# EAGLE design 1btn_v1 (EAGLE 7.3.0)
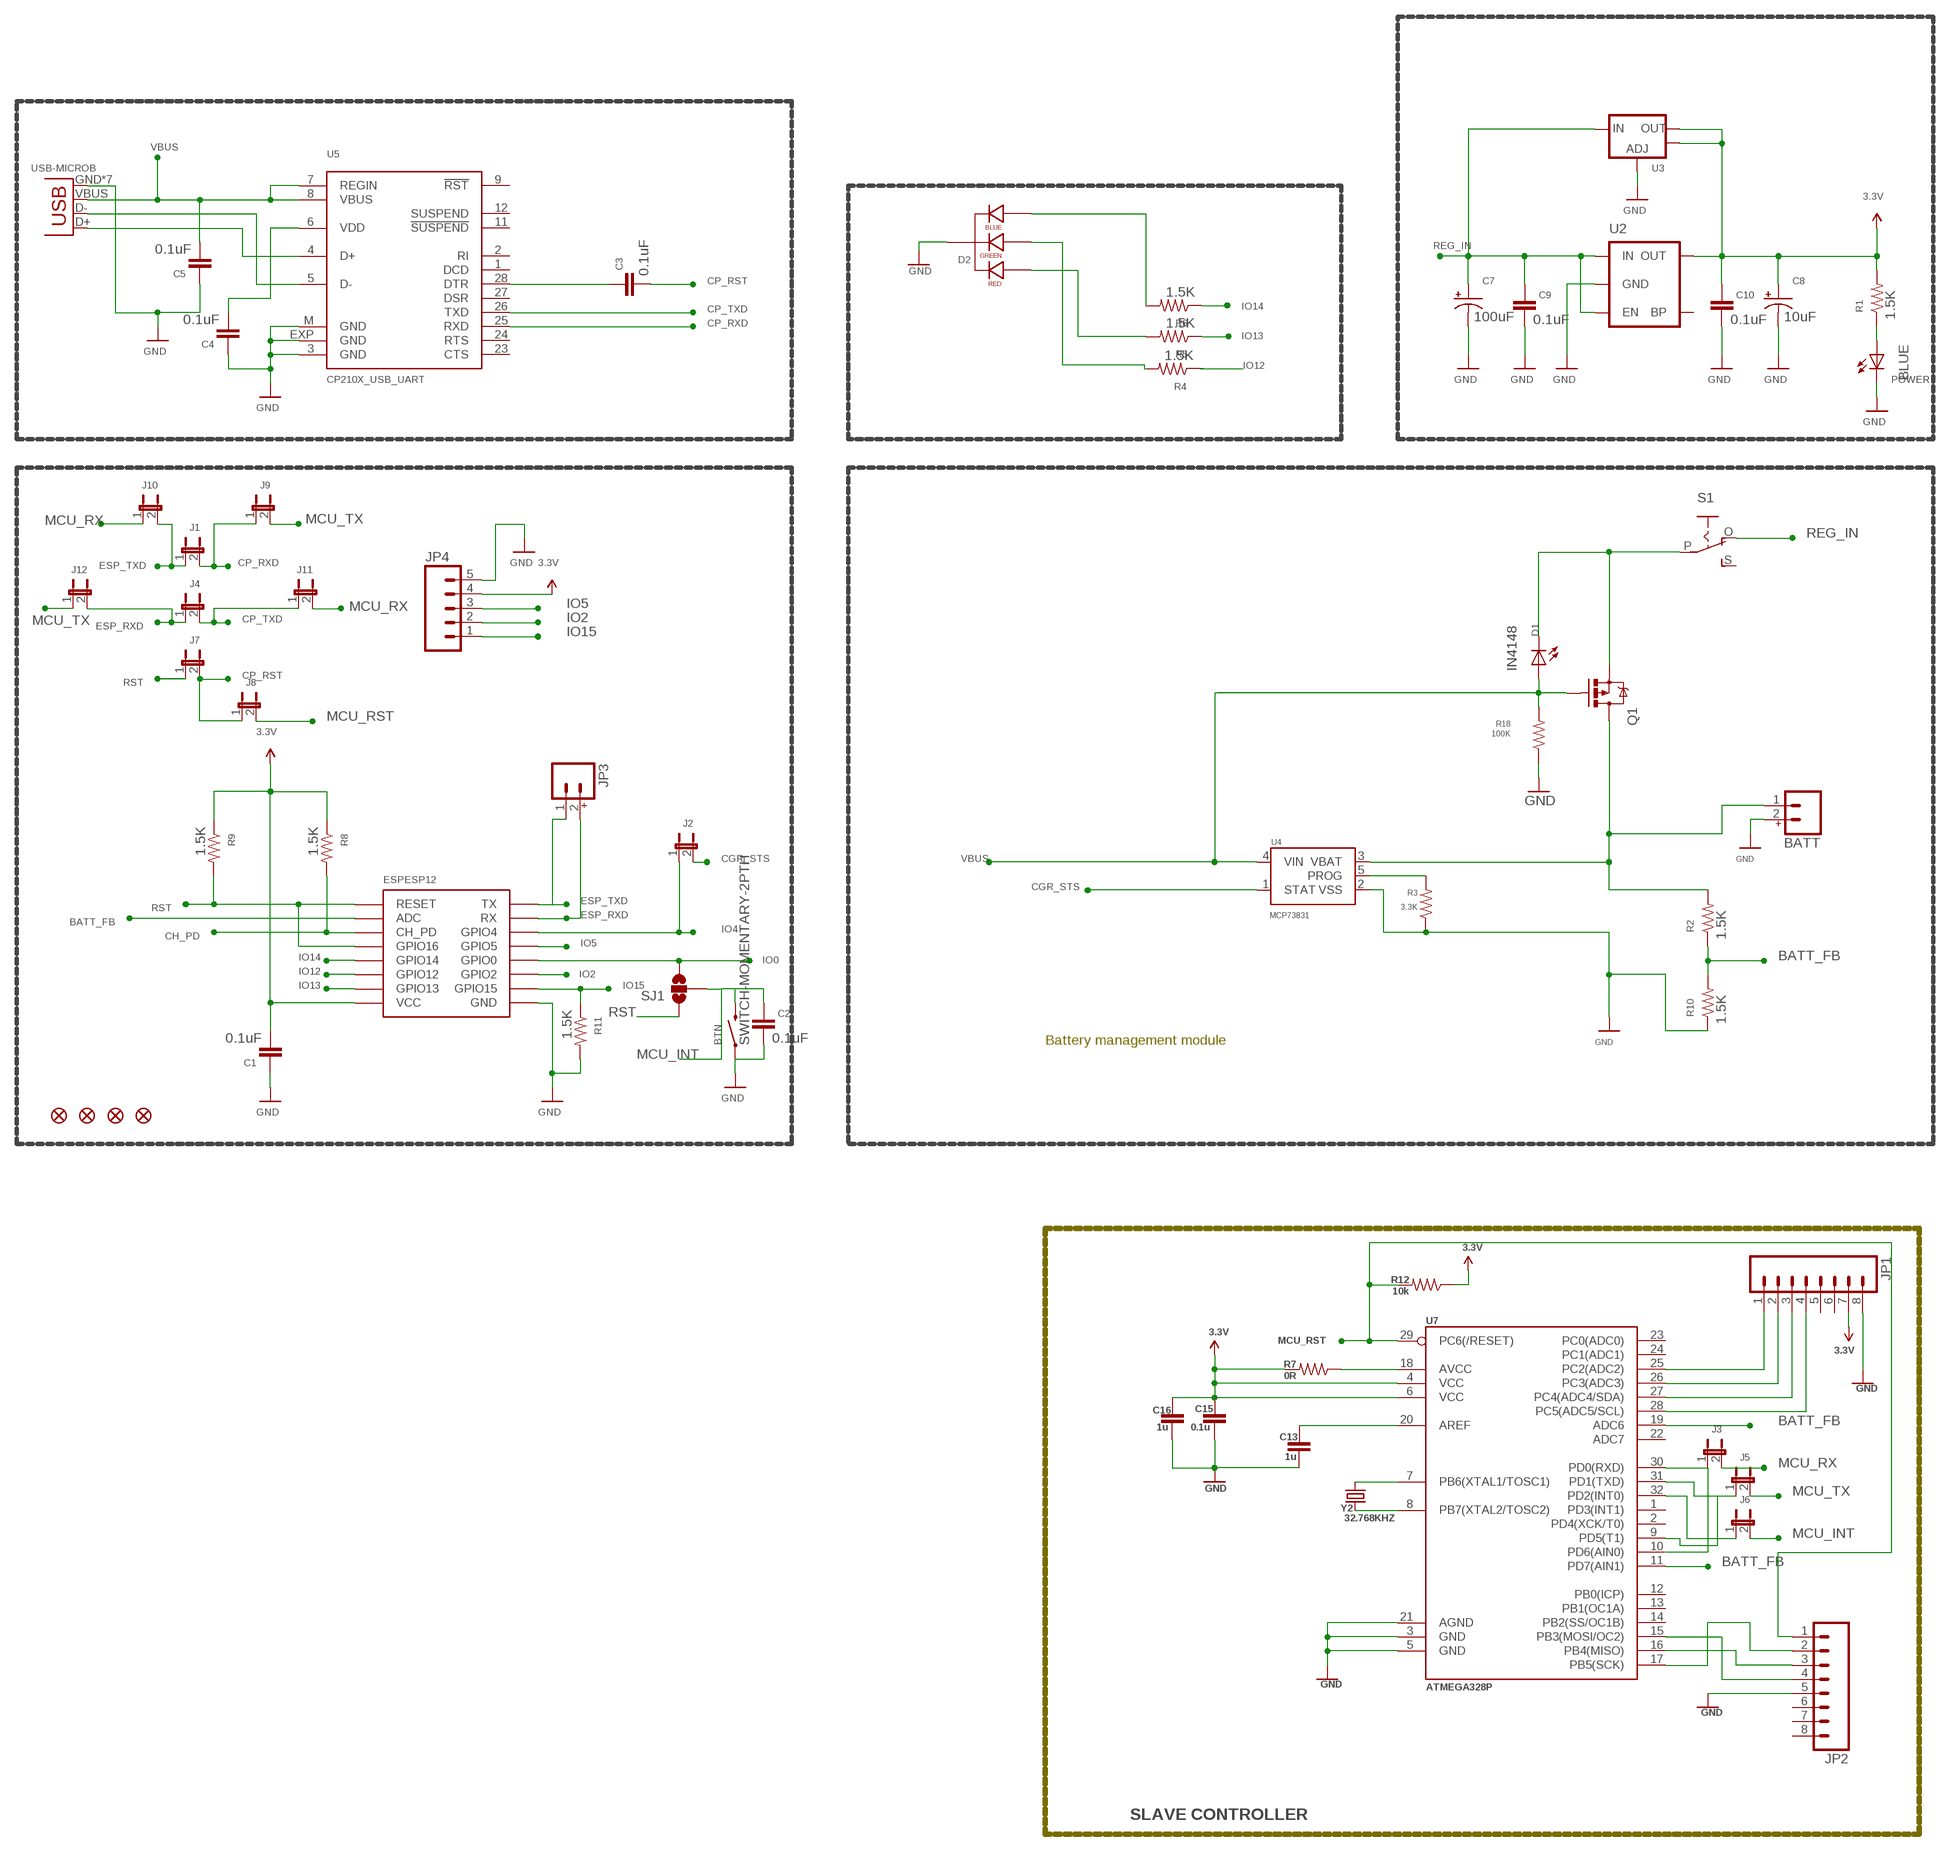
[diagram p0: schematic, sheet 1]

## Parts
BATT  M02JST-PTH-2  [JST-2-PTH]
BTN  SWITCH-MOMENTARY-2PTH  [TACTILE-PTH]
C1  0.1uF  CAP0805  [0805]
C2  0.1uF  CAP0805  [0805]
C3  0.1uF  CAP0805  [0805]
C4  0.1uF  CAP0805  [0805]
C5  0.1uF  CAP0805  [0805]
C7  100uF  CAP_POL1206-KIT  [EIA3216-KIT]
C8  10uF  CAP_POL1206-KIT  [EIA3216-KIT]
C9  0.1uF  CAP0805  [0805]
C10  0.1uF  CAP0805  [0805]
C13  1u  CAP0805  [0805]
C15  0.1u  CAP0805  [0805]
C16  1u  CAP0805  [0805]
D1  IN4148  LED1206  [LED-1206]
D2  LED-RGB-CC-THRUCLEAR  [LED-RGB-THRU]
ESP  ESP12  [ESP12]
FID1  FIDUCIAL1X2  [FIDUCIAL-1X2]
FID2  FIDUCIAL1X2  [FIDUCIAL-1X2]
FID3  FIDUCIAL1X2  [FIDUCIAL-1X2]
FID4  FIDUCIAL1X2  [FIDUCIAL-1X2]
J1  JUMPER-2SMD-NC  [SJ_2S]
J2  JUMPER-2SMD-NC  [SJ_2S]
J3  JUMPER-2SMD-NC  [SJ_2S]
J4  JUMPER-2SMD-NC  [SJ_2S]
J5  JUMPER-2SMD-NC  [SJ_2S]
J6  JUMPER-2SMD-NC  [SJ_2S]
J7  JUMPER-2SMD-NC  [SJ_2S]
J8  JUMPER-2SMD-NC  [SJ_2S]
J9  JUMPER-2SMD-NC  [SJ_2S]
J10  JUMPER-2SMD-NC  [SJ_2S]
J11  JUMPER-2SMD-NC  [SJ_2S]
J12  JUMPER-2SMD-NC  [SJ_2S]
JP1  M08NO_SILK  [1X08_PIN1_NO_SILK]
JP2  M08NO_SILK  [1X08_PIN1_NO_SILK]
JP3  M02PTH  [1X02]
JP4  M05PTH  [1X05]
POWER  BLUE  LED  [LED-0805]
Q1  MOSFET-PCHANNELSMD  [SOT23-3]
R1  1.5K  RESISTOR0805-RES  [0805]
R2  1.5K  RESISTOR0805-RES  [0805]
R3  3.3K  RESISTOR0805-RES  [0805]
R4  1.5K  RESISTOR0805-RES  [0805]
R5  1.5K  RESISTOR0805-RES  [0805]
R6  1.5K  RESISTOR0805-RES  [0805]
R7  0R  RESISTOR0805-RES  [0805]
R8  1.5K  RESISTOR0805-RES  [0805]
R9  1.5K  RESISTOR0805-RES  [0805]
R10  1.5K  RESISTOR0805-RES  [0805]
R11  1.5K  RESISTOR0805-RES  [0805]
R12  10k  RESISTOR0805-RES  [0805]
R18  100K  RESISTOR0805-RES  [0805]
S1  EG1218S  [EG1218]
SJ1  SOLDERJUMPER_2WAYS  [SJ_3]
U2  MIC52053.3V  [SOT23-5]
U3  V_REG_LM1117SOT223  [SOT223]
U4  MCP73831  [SOT23-5]
U5  CP210X_USB_UART  [MLP28]
U7  ATMEGA328P  ATMEGA328_SMT  [TQFP32-08]
USB  USB-MICROB  [USB-MICROB]
Y2  32.768KHZ  CRYSTALTC26H_EZ  [TC26HEZ]

## Nets
3.3V: C1.2 C8.A(+) C10.1 C15.1 C16.1 ESP.VCC JP1.7 JP4.4 R1.2 R7.2 R8.1 R9.1 R12.1 U2.5(OUT) U3.2(OUT) U3.4(OUT) U7.4(VCC) U7.6(VCC)
BA: D2.3(GREEN_CATHODE) R4.2
BATT+: BATT.1 Q1.3(D) R2.2 U4.3(VBAT)
BATT_FB: ESP.ADC R2.1 R10.2 U7.11(PD7(AIN1)) U7.19(ADC6)
CGR_STS: J2.2 U4.1(STAT)
CH_PD: ESP.CH_PD R8.2
CP_RST: C3.2 J7.2 J8.1
CP_RXD: J1.2 J9.1 U5.25(RXD)
CP_TXD: J4.2 J11.1 U5.26(TXD)
ESP_RXD: ESP.RX J4.1 J12.2 JP3.2
ESP_TXD: ESP.TX J1.1 J10.2 JP3.1
GND: BATT.2 BTN.1 C1.1 C2.2 C4.1 C5.1 C7.C(-) C8.C(-) C9.2 C10.2 C13.2 C15.2 C16.2 D2.2(CATHODE) ESP.GND JP1.8 JP2.5 JP4.5 POWER.2(C) R3.1 R10.1 R11.2 R18.1 U2.2(GND) U3.1(ADJ) U4.2(VSS) U5.3(GND) U5.EXP(GND) U5.M(GND) U7.3(GND) U7.5(GND) U7.21(AGND) USB.GND USB.MT1(GND) USB.MT2(GND) USB.MT3(GND) USB.MT4(GND) USB.P$1(GND) USB.P$2(GND)
IO0: ESP.GPIO0 SJ1.3
IO2: ESP.GPIO2 JP4.2
IO4: ESP.GPIO4 J2.1
IO5: ESP.GPIO5 JP4.3
IO12: ESP.GPIO12 R4.1
IO13: ESP.GPIO13 R5.1
IO14: ESP.GPIO14 R6.1
IO15: ESP.GPIO15 JP4.1 R11.1
MCU_INT: BTN.3 C2.1 J6.2 SJ1.2
MCU_RST: J8.2 JP2.1 R12.2 U7.29(PC6(/RESET))
MCU_RX: J3.2 J10.1 J11.2
MCU_TX: J5.2 J9.2 J12.1
N$1: D2.1(RED_CATHODE) R5.2
N$2: D2.4(BLUE_CATHODE) R6.2
N$4: D1.C Q1.2(S) S1.P
N$5: U5.5(D-) USB.D-
N$6: C3.1 U5.28(DTR)
N$7: POWER.1(A) R1.1
N$8: U5.4(D+) USB.D+
N$11: JP1.1 U7.25(PC2(ADC2))
N$12: JP1.2 U7.26(PC3(ADC3))
N$13: JP1.3 U7.27(PC4(ADC4/SDA))
N$14: JP1.4 U7.28(PC5(ADC5/SCL))
N$15: R3.2 U4.5(PROG)
N$16: JP2.4 U7.15(PB3(MOSI/OC2))
N$17: JP2.3 U7.16(PB4(MISO))
N$18: JP2.2 U7.17(PB5(SCK))
N$19: J3.1 U7.10(PD6(AIN0)) U7.30(PD0(RXD))
N$20: J6.1 U7.32(PD2(INT0))
N$21: J5.1 U7.9(PD5(T1)) U7.31(PD1(TXD))
N$28: U7.7(PB6(XTAL1/TOSC1)) Y2.2
N$29: U7.8(PB7(XTAL2/TOSC2)) Y2.1
N$30: C13.1 U7.20(AREF)
N$33: R7.1 U7.18(AVCC)
REG_IN: C7.A(+) C9.1 S1.O U2.1(IN) U2.3(EN) U3.3(IN)
RST: ESP.GPIO16 ESP.RESET J7.1 R9.2 SJ1.1
VBUS: C5.2 D1.A Q1.1(G) R18.2 U4.4(VIN) U5.7(REGIN) U5.8(VBUS) USB.VBUS
VDD: C4.2 U5.6(VDD)
Unconnected: JP1.5 JP1.6 JP2.6 JP2.7 JP2.8 S1.S U2.4(BP) U5.1(DCD) U5.2(RI) U5.9(!RST) U5.11(!SUSPEND) U5.12(SUSPEND) U5.23(CTS) U5.24(RTS) U5.27(DSR) U7.1(PD3(INT1)) U7.2(PD4(XCK/T0)) U7.12(PB0(ICP)) U7.13(PB1(OC1A)) U7.14(PB2(SS/OC1B)) U7.22(ADC7) U7.23(PC0(ADC0)) U7.24(PC1(ADC1))

## Notes on the sheet
- Battery management module
- SLAVE CONTROLLER

## Library data of the parts
BATT = SparkFun-Connectors:M02: Standard 2-pin 0.1" header. Use with - straight break away headers ( PRT-00116) - right angle break away headers (PRT-00553) - swiss pins (PRT-00743) - machine pins (PRT-00117) - female headers (PRT-00115) Molex polarized connector foot print use with: PRT-08233 with associated crimp pins and housings. 2.54_SCREWTERM for use with PRT-10571. 3.5mm Screw Terminal footprints for PRT-08084 5mm Screw Terminal footprints for use with PRT-08432; PROD_ID: CONN-09863; SKU: PRT-09914
BTN = SparkFun-Electromechanical:SWITCH-MOMENTARY-2: Various NO switches- pushbuttons, reed, etc
C1-C5 C9 C10 = SparkFun-Passives:CAP: Capacitor Standard 0603 ceramic capacitor, and 0.1" leaded capacitor.
C7 C8 = SparkFun-Passives:CAP_POL: Capacitor Polarized These are standard SMD and PTH capacitors. Normally 10uF, 47uF, and 100uF in electrolytic and tantalum varieties. Always verify the external diameter of the through hole cap, it varies with capacity, voltage, and manufacturer. The EIA devices should be standard.
C13 C15 C16 = SparkFun-Capacitors:CAP: Capacitor Standard 0603 ceramic capacitor, and 0.1" leaded capacitor.
D1 POWER = SparkFun-LED:LED: LEDs Standard schematic elements and footprints for 5mm, 3mm, 1206, and 0603 sized LEDs. 5mm - Spark Fun Electronics SKU : COM-00529 (and others)
D2 = SparkFun-LED:LED-RGB-CC-THRU: RGB Through-hole common cathode LED SparkFun Storefront: COM-00105 (Clear) COM-09264 (Diffuse); PROD_ID: DIO-08418
ESP = esp8266modules:ESP12: ESP8266 Wifi module 12
FID1-FID4 = SparkFun-Aesthetics:FIDUCIAL: Fiducial Alignment Points Various fiducial points for machine vision alignment.
J1-J12 = SparkFun-Passives:JUMPER-2: Jumper Basic 0.1" spaced jumper. Use with breakaway headers.
JP1 JP2 = SparkFun-Connectors:M08: Header 8 Standard 8-pin 0.1" header. Use with straight break away headers (SKU : PRT-00116), right angle break away headers (PRT-00553), swiss pins (PRT-00743), machine pins (PRT-00117), and female headers (PRT-00115).
JP3 = SparkFun-Connectors:M02: Standard 2-pin 0.1" header. Use with - straight break away headers ( PRT-00116) - right angle break away headers (PRT-00553) - swiss pins (PRT-00743) - machine pins (PRT-00117) - female headers (PRT-00115) Molex polarized connector foot print use with: PRT-08233 with associated crimp pins and housings. 2.54_SCREWTERM for use with PRT-10571. 3.5mm Screw Terminal footprints for PRT-08084 5mm Screw Terminal footprints for use with PRT-08432
JP4 = SparkFun-Connectors:M05: Header 5 Standard 5-pin 0.1" header. Use with straight break away headers (SKU : PRT-00116), right angle break away headers (PRT-00553), swiss pins (PRT-00743), machine pins (PRT-00117), and female headers (PRT-00115). Molex polarized connector foot print use with SKU : PRT-08230 with associated crimp pins and housings.
Q1 = SparkFun-DiscreteSemi:MOSFET-PCHANNEL: Generic PMOSFET
R1-R12 R18 = SparkFun-Resistors:RESISTOR: Resistor Basic schematic elements and footprints for 0603, 1206, and PTH resistors.
S1 = adafruit:EG1218: SLIDING SWITCH 0.1" spacing through hole, vertical SPDT slide switch http://www.ladyada.net/library/pcb/eaglelibrary.html
SJ1 = SparkFun-Passives:SOLDERJUMPER_2WAY: Solder Jumper 2 way solder jumper
U2 = SparkFun-PowerIC:MIC5205: MIC5205 150mA vreg 3.3V - VREG-00822 5V - VREG-00823; PROD_ID: VREG-00822
U3 = SparkFun-PowerIC:V_REG_LM1117: Voltage Regulator LM1117 Standard adjustable voltage regulator but in SMD form. Spark Fun Electronics SKU : COM-00595
U4 = SparkFun-PowerIC:MCP73831: Miniature single cell, fully integrated Li-Ion, Li-polymer charge management controller http://ww1.microchip.com/downloads/en/DeviceDoc/21984a.pdf IC-09995; PROD_ID: IC-09995
U5 = SparkFun-DigitalIC:CP210X_USB_UART: Single-Chip USB to UART Bridge Source: www.silabs.com .. CP2101.pdf / cp2102.pdf. Spark Fun Electronics SKU : COM-00310
U7 = SparkFun-DigitalIC:ATMEGA328_SMT: 32-Pin Atmega328 part Commonly used on Arduino compatible boards Available in QFP and QFN packages TQFP is IC-09069 QFN is non-stock; PROD_ID: IC-09069
USB = SparkFun-Connectors:USB: USB Connectors USB-B-PTH is fully proven SKU : PRT-00139/CONN-08278 USB-miniB is fully proven SKU : PRT-00587 USB-A-PCB is untested. USB-A-H is throughly reviewed, but untested. Spark Fun Electronics SKU : PRT-00437 USB-B-SMT is throughly reviewed, but untested. Needs silkscreen touching up. USB-A-S has not been used/tested USB-MB-H has not been used/tested USB-MICROB has been used. CONN-09505; PROD_ID: CONN-09505
Y2 = SparkFun-FreqCtrl:CRYSTAL: Various standard crystals. Proven footprints. Spark Fun Electronics SKU : COM-00534

## Board
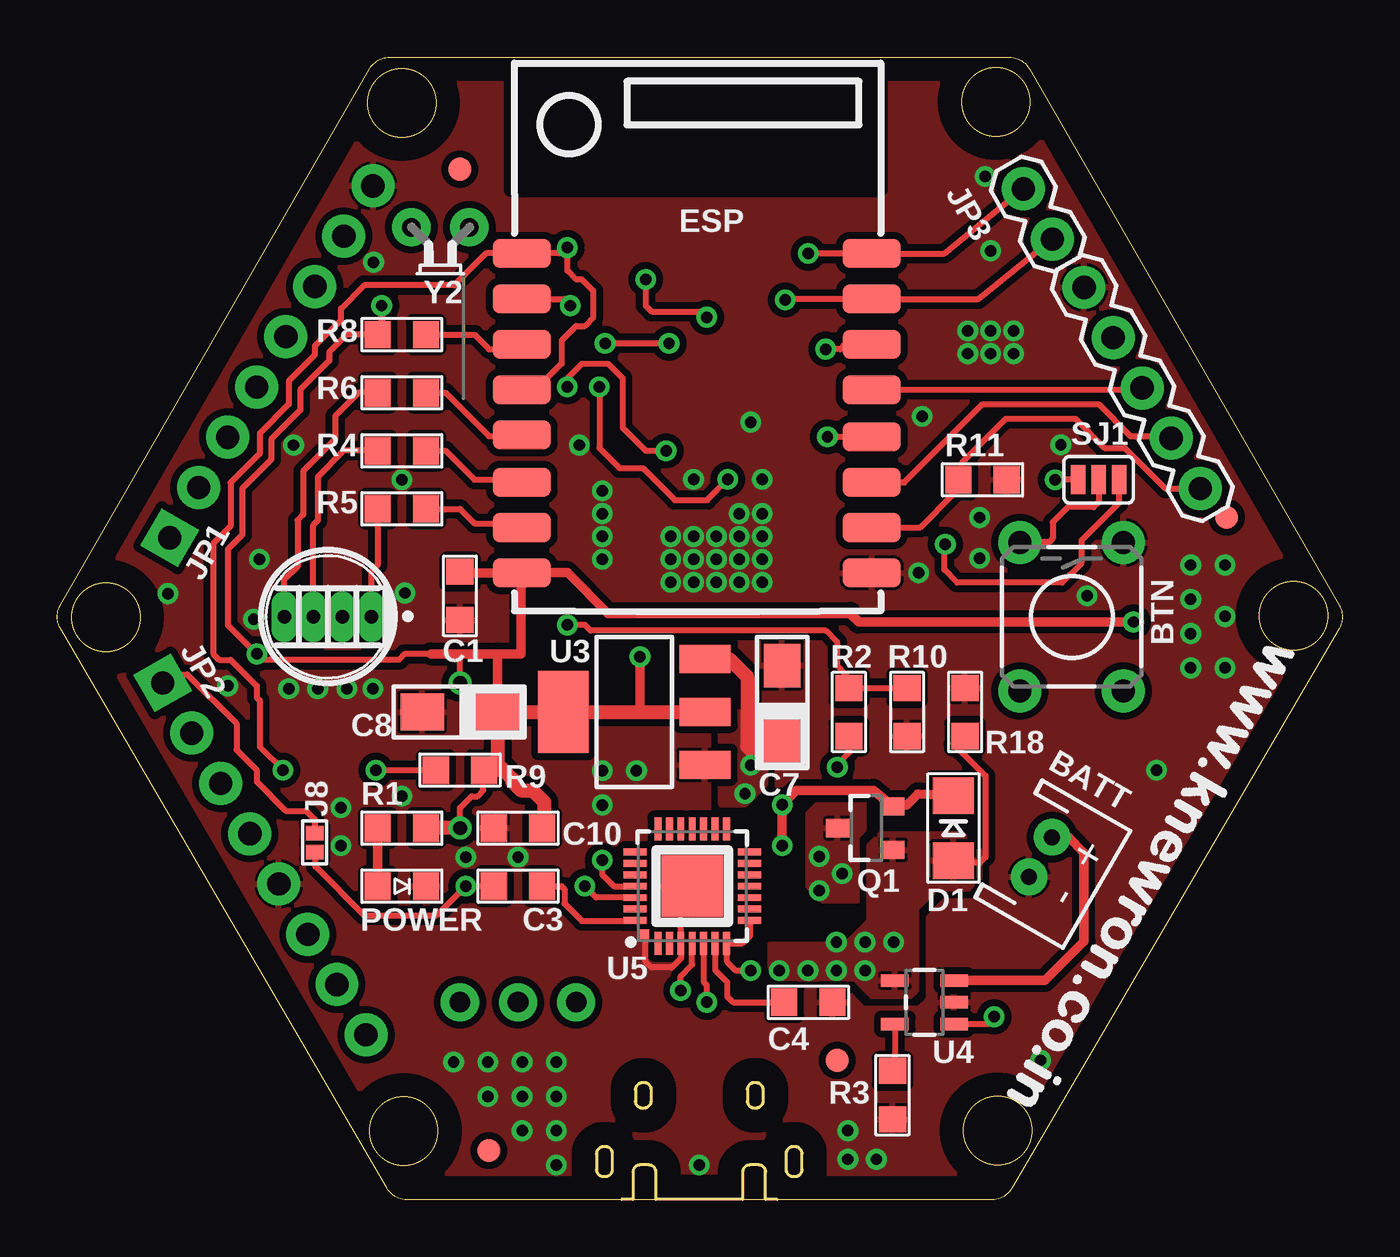
[diagram p1: board, top side]
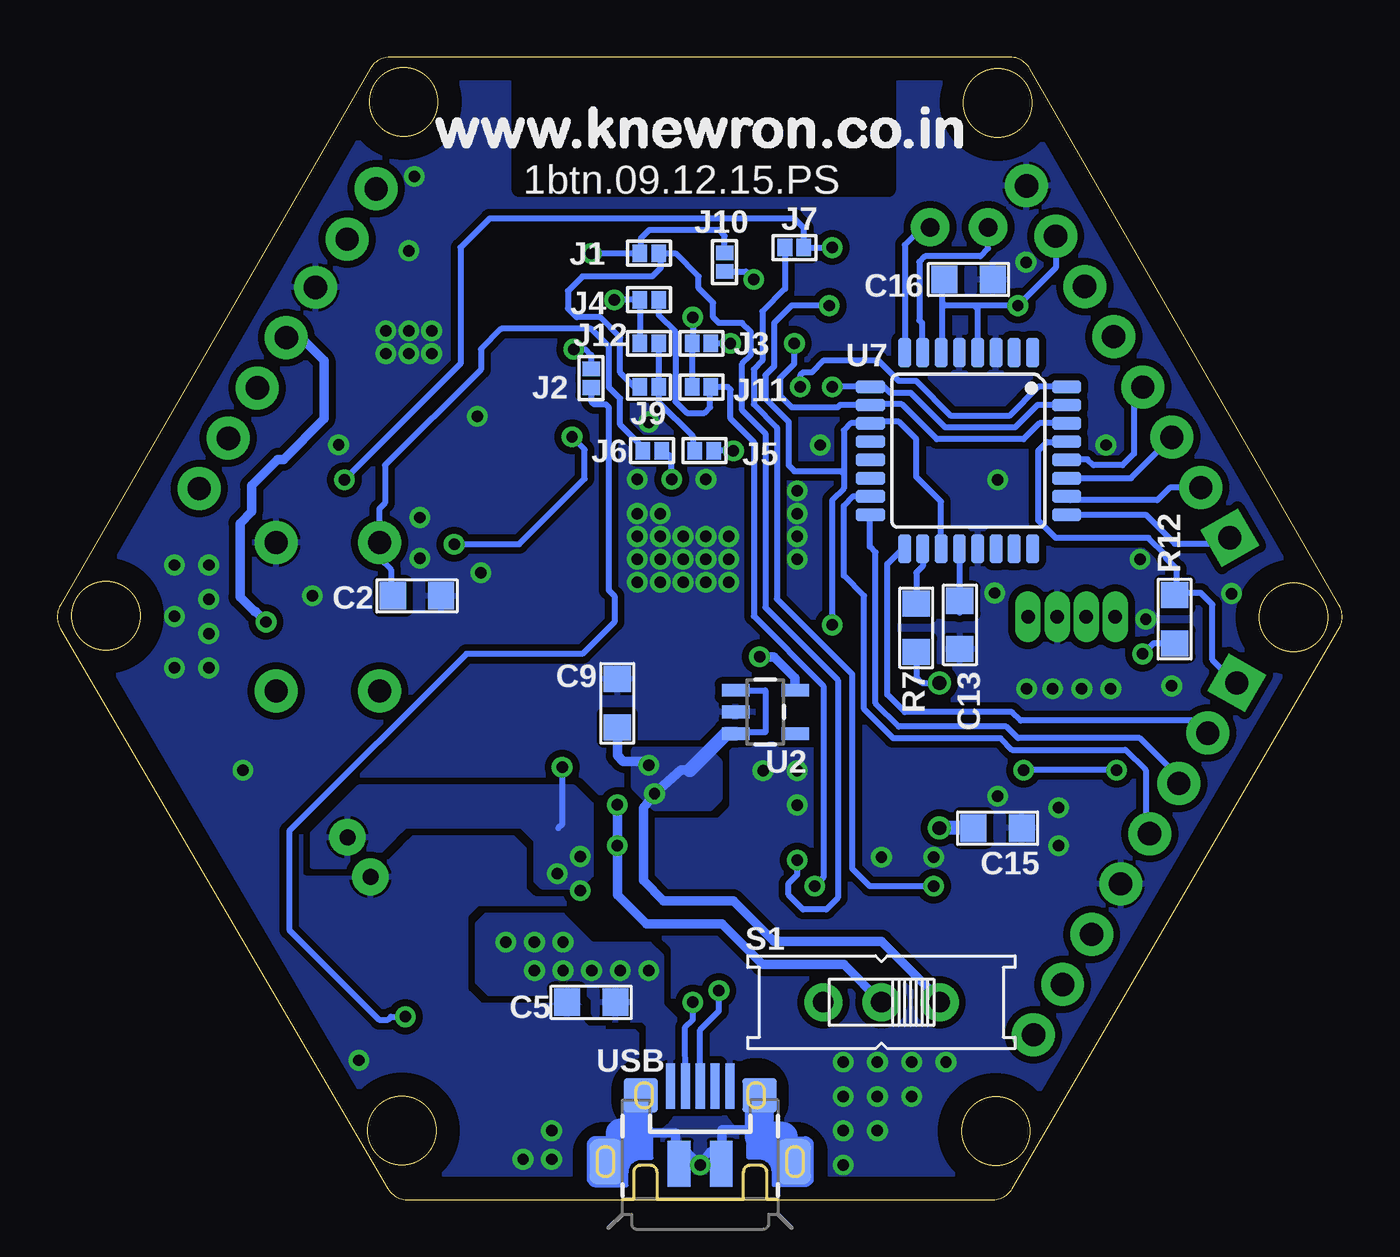
[diagram p2: board, bottom side, seen from below]

Size 56.23 x 49.99 mm. Coordinates in mm from the lower left corner, seen from the top.
Outline: 0.13,26 13.68,49.49 arc-60 14.54,49.99 41.66,49.99 arc-60 42.52,49.49 56.09,26.01 arc-60 56.09,25 41.76,0.49 arc-60 40.9,0 15.3,0 arc-60 14.44,0.5 0.14,25 arc-60 0.13,26
Outline: circle at 15.08,47.98 radius 1.5
Outline: circle at 2.13,25.48 radius 1.5
Outline: circle at 15.16,3 radius 1.5
Outline: circle at 41.14,3.02 radius 1.5
Outline: circle at 54.1,25.55 radius 1.5
Outline: circle at 41.07,48.03 radius 1.5
Copper layers (1*16): Top 0.035mm / dielectric 1.5mm / Bottom 0.035mm
Design rules "default *": minimum track width 10mil, minimum drill 18mil, track to track 10mil, track to pad 10mil, pad to pad 10mil, via to via 10mil, smd to smd 1mil, copper to edge 40mil, drill to drill 8mil, minimum pad ring 10mil, minimum via ring 8mil, stop-mask expansion 20mil, vias tented up to drill 20mil, thermal gap 5mil

### Footprints (pad centres in the part's own frame; a part is rotated, then mirrored left to right if it is on the bottom)
JST-2-PTH = drill 0.7 pad 1.6: 1 -1,0; 2 1,0
TACTILE-PTH = drill 1.016 pad 1.88: 1 -3.251,2.261; 2 3.251,2.261; 3 -3.251,-2.261; 4 3.251,-2.261
0805 = smd 1.143 x 1.2: 1 -1.059,0; 2 1.059,0
EIA3216-KIT = smd 1.9 x 1.6: A 1.65,0; C -1.65,0
LED-1206 = smd 1.6 x 1.8: A -1.421,0; C 1.421,0
LED-RGB-THRU = drill 0.6 pad 0.61 long: 1 1.905,0; 2 0.635,0; 3 -0.635,0; 4 -1.905,0
ESP12 = smd 2.54 x 1.27: ADC -7.779,3.81; CH_PD -7.779,1.826; GND 7.541,-8.176; GPIO0 7.541,-2.223; GPIO2 7.541,-4.207; GPIO4 7.541,1.826; GPIO5 7.541,-0.159; GPIO12 -7.779,-4.207; GPIO13 -7.779,-6.191; GPIO14 -7.779,-2.143; GPIO15 7.541,-6.191; GPIO16 -7.779,-0.159; RESET -7.779,5.794; RX 7.541,3.81; TX 7.541,5.794; VCC -7.779,-8.176
FIDUCIAL-1X2 = smd 1 x 1: 1 0,0
SJ_2S = smd 0.635 x 0.762: 1 -0.412,0; 2 0.412,0
1X08_PIN1_NO_SILK = drill 1.016 pad 1.88 square: 1 0,0 | drill 1.016 pad 1.88: 2 2.54,0; 3 5.08,0; 4 7.62,0; 5 10.16,0; 6 12.7,0; 7 15.24,0; 8 17.78,0
1X02 = drill 1.016 pad 1.88: 1 0,0; 2 2.54,0
1X05 = drill 1.016 pad 1.88: 1 0,0; 2 2.54,0; 3 5.08,0; 4 7.62,0; 5 10.16,0
LED-0805 = smd 1.143 x 1.2: 1 -1.059,0; 2 1.059,0
SOT23-3 = smd 0.8 x 1.016: 1 -0.95,-1.159; 2 0.95,-1.159; 3 0,1.259
EG1218 = drill 0.9 pad 1.676: O -2.54,0; P 0,0; S 2.54,0
SJ_3 = smd 0.635 x 1.27: 1 -0.889,0; 2 0,0; 3 0.889,0
SOT23-5 = smd 0.55 x 1.2: 1 -0.95,-1.3; 2 0,-1.3; 3 0.95,-1.3; 4 0.95,1.3; 5 -0.95,1.3
SOT223 = smd 1.219 x 2.235: 1 -2.311,-3.099; 2 0,-3.099; 3 2.311,-3.099 | smd 3.6 x 2.2: 4 0,3.099
MLP28 = smd 1 x 0.3: 1 -2.5,1.5; 2 -2.5,1; 3 -2.5,0.5; 4 -2.5,0; 5 -2.5,-0.5; 6 -2.5,-1; 7 -2.5,-1.5; 15 2.5,-1.5; 16 2.5,-1; 17 2.5,-0.5; 18 2.5,0; 19 2.5,0.5; 20 2.5,1; 21 2.5,1.5 | smd 0.3 x 1: 8 -1.5,-2.5; 9 -1,-2.5; 10 -0.5,-2.5; 11 0,-2.5; 12 0.5,-2.5; 13 1,-2.5; 14 1.5,-2.5; 22 1.5,2.5; 23 1,2.5; 24 0.5,2.5; 25 0,2.5; 26 -0.5,2.5; 27 -1,2.5; 28 -1.5,2.5 | smd 2.7 x 2.7: EXP 0,0 | smd 0.435 x 0.435: M -2.103,2.103
TQFP32-08 = smd 1.27 x 0.559: 1 -4.293,2.8; 2 -4.293,2; 3 -4.293,1.2; 4 -4.293,0.4; 5 -4.293,-0.4; 6 -4.293,-1.2; 7 -4.293,-2; 8 -4.293,-2.8; 17 4.293,-2.8; 18 4.293,-2; 19 4.293,-1.2; 20 4.293,-0.4; 21 4.293,0.4; 22 4.293,1.2; 23 4.293,2; 24 4.293,2.8 | smd 0.559 x 1.27: 9 -2.8,-4.293; 10 -2,-4.293; 11 -1.2,-4.293; 12 -0.4,-4.293; 13 0.4,-4.293; 14 1.2,-4.293; 15 2,-4.293; 16 2.8,-4.293; 25 2.8,4.293; 26 2,4.293; 27 1.2,4.293; 28 0.4,4.293; 29 -0.4,4.293; 30 -1.2,4.293; 31 -2,4.293; 32 -2.8,4.293
USB-MICROB = smd 0.4 x 2: D+ 0,3.45; D- -0.65,3.45; GND 1.3,3.45; ID 0.65,3.45; VBUS -1.3,3.45 | smd 1.5 x 2: MT1 -4.1,0.15; MT2 4.1,0.15 | smd 1.5 x 1.5: MT3 -2.6,3.05; MT4 2.6,3.05 | smd 1 x 2: P$1 -0.92,0.05; P$2 0.92,0.05
TC26HEZ = drill 0.813 pad 1.676: 1 -1.27,0; 2 1.27,0

### Placement (x,y rotation side)
BATT  43.02,14.99 240 top
BTN  44.38,25.5 270 top
C1  17.62,26.42 90 top
C2  40.48,26.42 0 bottom
C3  20.16,13.72 180 top
C4  32.86,8.64 180 top
C5  32.86,8.64 0 bottom
C7  31.72,21.72 270 top
C8  17.62,21.34 0 top
C9  31.72,21.72 90 bottom
C10  20.16,16.26 180 top
C13  16.73,25.15 270 bottom
C15  15.08,16.26 0 bottom
C16  16.35,40.26 0 bottom
D1  39.21,16.26 90 top
D2  11.84,25.5 0 top
ESP  28.1,35.6 0 top
FID1  34.13,6.1 0 top
FID2  18.89,2.16 0 top
FID3  51.15,29.84 0 top
FID4  17.62,45.09 0 top
J1  30.32,41.4 0 bottom
J2  32.86,35.94 270 bottom
J3  28.04,37.46 180 bottom
J4  30.32,39.37 0 bottom
J5  27.91,32.77 180 bottom
J6  30.2,32.77 180 bottom
J7  23.97,41.66 180 bottom
J8  11.27,15.62 90 top
J9  30.32,35.56 0 bottom
J10  27.02,41.02 90 bottom
J11  28.04,35.56 180 bottom
J12  30.32,37.46 180 bottom
JP1  4.92,28.96 60 top
JP2  4.62,22.61 300 top
JP3  42.27,44.22 300 top
JP4  50.01,31.12 120 top
POWER  15.08,13.72 0 top
Q1  35.4,16.26 90 top
R1  15.08,16.26 0 top
R2  34.64,21.34 270 top
R3  36.55,4.57 90 top
R4  15.08,32.77 180 top
R5  15.08,30.23 180 top
R6  15.08,35.31 180 top
R7  18.64,25.02 270 bottom
R8  15.08,37.85 0 top
R9  17.62,18.8 180 top
R10  37.18,21.34 90 top
R11  40.48,31.5 0 top
R12  7.34,25.4 90 bottom
R18  39.72,21.34 270 top
S1  20.16,8.64 180 bottom
SJ1  45.56,31.5 0 top
U2  25.24,21.34 270 bottom
U3  25.24,21.34 90 top
U4  37.94,8.64 90 top
U5  27.78,13.72 90 top
U7  16.35,32.77 270 bottom
U$2  [WEBLINK-2]  52.96,24.82 240 top
U$3  [WEBLINK-2]  39.84,45.82 0 bottom
USB  28.09,1.52 0 bottom
Y2  16.77,42.55 180 top

### Tracks (layer width: path | path; a pad name or v marks a point on that pad's centre or on a via)
3.3V  (via drill 0.5, 0.6)
  Top 0.254: v17.62,16.26 17.62,17.15 18.13,17.65 18.39,17.65 18.64,17.91 18.64,18.75 R9.1 | v17.62,22.61 17.62,23.75 17.75,23.88 | 16.35,23.88 15.21,23.88 14.96,23.62 8.99,23.62 v8.73,23.88 7.46,25.15 7.46,28.45 8.1,29.08 8.1,31.12 9.37,32.38 9.37,33.27 10.64,34.54 10.64,35.43 11.91,36.7 11.91,37.08 12.67,37.85 R8.1
  Top 0.305: v14.19,39.12 14.19,37.86 R8.1
  Top 0.406: ESP.VCC 20.29,27.39 20.29,23.88 19.27,23.88 | ESP.VCC 17.68,27.42 C1.2 | v47.09,25.27 35.07,25.27 34.69,25.65 24.1,25.65 22.32,27.43 ESP.VCC | 16.35,23.88 17.75,23.88 19.27,23.88 | C8.A 19.27,23.88 | v25.5,23.75 25.5,21.46 25.37,21.34
  Top 0.61: U3.2 25.37,21.34 U3.4 C8.A 19.27,19.05 19.53,18.8 | R9.1 19.53,18.8 | 19.53,18.8 19.91,18.41 19.91,18.29 20.29,17.91 20.8,17.91 21.31,17.4 21.31,16.34 C10.1 | v17.62,16.26 C15.1
  Bottom 0.254: JP1.7 12.54,40.77 v14.19,39.12 16.1,39.12 | 16.1,39.12 17.5,39.12 | U7.6 17.5,37.12 17.5,39.12 | U7.4 15.95,38.97 16.1,39.12 | R12.1 8.27,24.34 v8.73,23.88 | R7.2 18.64,22.86 18.39,22.61 v17.62,22.61 | C16.1 17.5,40.17 17.5,39.27 17.5,39.12
  Bottom 0.406: v47.09,25.27 47.54,25.73 47.6,25.73 48.23,26.37 48.23,29.59 47.72,30.1 47.72,31.24 46.58,32.38 46.33,32.38 44.55,34.16 44.55,36.7 45.56,37.71 JP4.4 | U2.5 23.94,22.83 24.86,23.75 v25.5,23.75
  Bottom 0.61: C15.1 v17.62,16.26
BA
  Top 0.254: R4.2 12.54,32.77 11.4,31.62 11.4,29.72 11.21,29.53 D2.3
BATT+  (via drill 0.5)
  Top 0.254: v34.13,18.92 34.13,19.05 34.64,19.56 R2.2
  Top 0.406: U4.3 43.21,9.59 44.93,11.3 44.93,15.18 44.26,15.85 BATT.1
  Bottom 0.254: v34.13,18.92 34.13,16.43 34.3,16.26
  other vias: 33.34,15.02 34.34,14.27 33.34,13.52
  pour Bottom (isolate 0.305): 32.86,16.26 32.86,17.15 32.86,17.27 33.63,18.03 43.02,18.03 45.06,16 45.06,14.61 42.77,14.61 41.5,15.88 40.99,16.38 35.91,16.38 35.28,15.75 35.28,13.97 35.02,13.72 33.37,13.72 32.99,14.1 32.86,14.22
  pour Top (isolate 0.305, rank 2): 32.86,16.26 32.86,16.89 33.88,17.91 34.9,17.91 35.28,17.53 35.28,13.34 35.02,13.08 33.5,13.08 32.86,13.72
BATT_FB  (via drill 0.5)
  Top 0.254: ESP.ADC 22.16,39.41 v22.45,39.12 | R10.2 R2.1 34.51,22.36 34.51,22.99 34.13,23.37 34.13,24.38 33.63,24.89 23.34,24.89 23.08,25.15 v22.32,25.15
  Bottom 0.254: U7.19 17.55,30.54 18.64,31.62 18.64,33.27 19.4,34.04 20.58,34.04 U7.11 21.5,33.97 21.81,33.66 21.81,31.75 | 21.81,31.75 21.81,31.12 22.32,30.61 v22.32,25.15 | v22.45,39.12 24.1,39.12 24.86,38.35 24.86,36.45 25.24,36.07 25.24,35.05 24.23,34.04 24.23,32.13 23.97,31.88 21.94,31.88 21.81,31.75
CGR_STS  (via drill 0.5)
  Top 0.254: U4.1 40.68,7.69 v40.99,8
  Bottom 0.254: v40.99,8 41.63,8 41.75,7.87 42.13,7.87 46.07,11.81 46.07,16.13 38.32,23.88 33.24,23.88 31.85,25.27 31.85,26.42 32.1,26.67 32.1,34.67 32.23,34.8 32.74,34.8 32.86,34.92 J2.2
CH_PD
  Top 0.254: R8.2 18.26,37.85 18.89,37.21 20.11,37.21 ESP.CH_PD
CP_RST  (via drill 0.5)
  Top 0.254: C3.2 v17.88,13.72 16.61,12.45 13.43,12.45 11.3,14.57 J8.1
  Bottom 0.254: v17.88,13.72 20.67,13.72 21.43,14.48 21.43,22.99 24.74,26.29 24.74,33.78 25.75,34.8 25.75,36.32 25.37,36.7 25.37,38.86 24.38,39.85 J7.2
CP_RXD  (via drill 0.5)
  Top 0.254: v23.85,14.86 23.85,14.22 24.35,13.72 U5.25
  Bottom 0.254: v23.85,14.86 23.85,14.22 24.23,13.84 24.23,13.34 23.59,12.7 22.58,12.7 22.07,13.21 22.07,22.73 25.24,25.91 25.24,33.53 26.26,34.54 26.26,36.58 25.88,36.96 25.88,37.97 26.26,38.35 27.28,38.35 27.53,38.61 27.53,39.24 28.16,39.88 28.16,40.39 29.18,41.4 J1.2 29.82,41.31 29.82,40.77 30.2,40.39 33.24,40.39 33.88,39.75 33.88,38.99 33.5,38.61 32.48,38.61 31.59,37.72 31.59,36.2 30.96,35.56 J9.1
CP_TXD  (via drill 0.5)
  Top 0.254: U5.26 23.58,13.22 v23.08,13.72
  Bottom 0.254: v23.08,13.72 22.7,14.1 22.7,22.48 25.75,25.53 25.75,33.15 26.77,34.16 26.77,35.43 26.89,35.56 J11.1 27.66,35.53 27.66,34.67 27.91,34.42 28.67,34.42 29.18,34.92 29.18,37.97 29.91,38.7 J4.2
ESP_RXD  (via drill 0.5)
  Top 0.254: JP3.2 40.3,39.41 ESP.RX 31.89,39.41 v31.85,39.37
  Bottom 0.254: J12.2 J4.1 v31.85,39.37
ESP_TXD  (via drill 0.5)
  Top 0.254: v32.86,41.4 32.87,41.39 ESP.TX 38.81,41.39 JP3.1
  Bottom 0.254: v32.86,41.4 J1.1 30.7,41.43 30.7,42.04 30.32,42.42 27.28,42.42 27.02,42.16 J10.2
GND  (via drill 0.5)
  Top 0.254: U5.M 25.75,11.54 25.75,10.41 26.01,10.16 26.89,10.16 27.28,10.55 U5.3 27.28,12.55 U5.EXP
  Bottom 0.254: USB.MT2 24.46,2.77 | USB.MT3 30.7,4.27 30.87,4.1
  Bottom 0.305: 29.18,1.65 28.68,2.15 v28.09,1.52 27.65,2.15 27.15,1.65
  Bottom 0.406: 31.59,2.41 32.2,2.41 USB.MT1 | 25.5,2.92 25.5,2.77 | USB.MT4 25.5,5.07 25.37,5.07 25.37,3.05 27.15,3.05 27.15,1.65 | 29.05,1.64 29.05,1.65 29.18,1.65 29.18,2.92 30.83,2.92
  Bottom 1.27: 24.46,2.77 25.5,2.77 USB.MT4 | 30.7,4.27 30.83,4.27 30.83,2.92 31.59,2.92 31.59,2.41
  other vias: 8.84,28.02 8.6,25.39 10.13,22.35 11.4,22.35 15.21,26.54 15.08,31.5 40.59,44.77 40.84,38.02 51.09,25.52 48.1,18.8 43.02,6.1 20.34,6.02 29.84,29.02 27.84,29.02 30.34,34.02 27.84,31.52 30.84,31.52 26.84,29.02 28.84,29.02 20.34,4.52 17.34,6.02 21.84,6.02 20.34,3.02 21.84,3.02 21.84,4.52 34.59,1.77 35.84,1.77 34.59,3.02 13.84,41.02 4.84,26.52 10.34,33.02 23.84,18.77 25.34,18.77 23.84,17.27 7.46,22.48 20.16,14.99 17.88,14.99 12.42,17.15 12.42,15.49 15.08,17.65 12.67,22.35 13.81,22.35 43.91,33.02 40.36,29.84 40.36,28.07 37.69,27.43 45.06,26.42 49.59,27.77 51.09,27.77 49.59,26.27 49.59,24.77 49.59,23.27 51.09,23.27 26.84,28.02 27.84,28.02 28.84,28.02 29.84,28.02 29.84,27.02 28.84,27.02 27.84,27.02 26.84,27.02 29.84,30.02 30.84,30.02 30.84,29.02 30.84,28.02 30.84,27.02 39.84,38.02 39.84,37.02 40.84,37.02 41.84,37.02 41.84,38.02 23.84,30.02 23.84,29.02 23.84,28.02 23.84,31.02 22.84,33.02 18.84,6.02 18.84,4.52 21.84,1.52 40.84,41.52 37.84,34.27
  pour Bottom (isolate 0.305, rank 3): -2.7,51.82 58.26,51.82 58.26,-1.52 -2.7,-1.52
  pour Top (isolate 0.305, rank 3): 7.46,51.82 -0.16,44.2 -0.16,-4.06 55.72,-4.06 58.26,3.56 58.26,46.74 53.18,51.82
IO0  (via drill 0.5)
  Top 0.254: SJ1.3 46.45,30.48 44.83,28.85 44.83,27.86 43.96,27 39.37,27 38.81,27.56 38.81,28.63 v38.86,28.68 | v33.7,33.38 ESP.GPIO0 | ESP.GPIO0
  Bottom 0.254: v38.86,28.68 36.01,28.68 33.14,31.55 33.14,32.82 v33.7,33.38
IO2
  Top 0.254: 35.75,31.5 ESP.GPIO2 35.66,31.37 37.05,31.37 40.48,34.8 45.56,34.8 46.96,33.4 48.4,33.4 JP4.2
IO4  (via drill 0.5)
  Top 0.254: ESP.GPIO4 34.47,37.42 34.26,37.21 v33.63,37.21
  Bottom 0.254: v33.63,37.21 33.12,37.21 32.86,36.96 J2.1
IO5
  Top 0.254: ESP.GPIO5 47.21,35.44 JP4.3
IO12
  Top 0.254: R4.1 16.99,32.77 18.26,31.5 20.22,31.5 ESP.GPIO12
IO13
  Top 0.254: R5.1 17.62,30.23 18.26,29.59 20.14,29.59 ESP.GPIO13
IO14
  Top 0.254: R6.1 16.99,35.31 18.89,33.4 20.27,33.4 ESP.GPIO14
IO15
  Top 0.254: ESP.GPIO15 37.76,29.41 39.21,30.86 39.21,31.13 R11.1 39.58,32.25 41.5,34.16 44.55,34.16 45.82,32.89 46.71,32.89 48.48,31.12 JP4.1
MCU_INT
  Top 0.254: SJ1.2 45.56,30.53 45.33,30.3 44.22,30.3 43.56,29.64 43.56,28.93 43.4,28.78 42.15,28.78 BTN.3
  Bottom 0.254: J6.2 30.61,32.92 31.59,33.91 31.59,35.05 32.1,35.56 32.1,37.34 32.86,38.1 36.8,38.1 37.69,37.21 37.69,36.32 41.88,32.13 41.88,30.48 42.13,30.23 BTN.3 42.12,28.06 41.63,27.56 41.63,26.5 C2.1
MCU_RST
  Top 0.254: JP2.1 4.99,22.99 5.69,22.99 7.84,20.83 7.84,19.69 8.73,18.8 8.73,18.29 10,17.02 10.89,17.02 11.27,16.64 J8.2
  Bottom 0.254: JP2.1 4.67,22.61 5.69,23.62 5.69,26.03 6.19,26.54 7.25,26.54 | 7.25,26.54 R12.2 | 7.25,26.54 7.25,27.6 7.72,28.07 7.72,28.19 8.48,28.96 12.54,28.96 13.31,29.72 13.31,32.77 12.92,33.15 12.08,33.15 U7.29
MCU_RX  (via drill 0.5)
  Top 0.254: v25.75,40.26 25.75,39.12 26.01,38.86 28.16,38.86 v28.42,38.61
  Bottom 0.254: J11.2 J3.2 28.42,37.5 v28.42,38.61 | J10.1 26.1,40.61 v25.75,40.26
MCU_TX
  Bottom 0.254: J12.1 J9.2 29.91,34.89 28.42,33.4 28.42,32.86 J5.2
N$1
  Top 0.254: R5.2 14.02,27.77 13.75,27.49 D2.1
N$2
  Top 0.254: R6.2 13.18,35.31 12.16,34.29 12.16,33.27 10.77,31.88 10.77,29.97 10.51,29.72 10.51,27.69 9.94,27.11 D2.4
N$4  (via drill 0.5)
  Top 0.406: D1.C 37.67,17.76 37.18,17.27 36.47,17.27 Q1.2 35.7,17.91 32.36,17.91 v31.72,17.27 31.72,15.62
  Bottom 0.406: v31.72,17.27 v31.72,15.49 31.72,13.34 30.45,12.06 27.15,12.06 25.37,10.29 21.81,10.29 S1.P
N$5  (via drill 0.5)
  Top 0.254: U5.5 28.28,9.53 28.42,9.4 v28.42,8.64
  Bottom 0.254: USB.D- 28.75,7.54 28.42,7.87 v28.42,8.64
N$6
  Top 0.254: C3.1 22.07,13.72 22.2,13.59 22.2,12.95 22.96,12.19 25.26,12.19 U5.28
N$7
  Top 0.406: R1.1 POWER.1
N$8  (via drill 0.5)
  Top 0.254: v27.28,9.14 27.28,9.78 27.78,10.29 U5.4
  Bottom 0.254: USB.D+ 28.1,7.43 27.28,8.25 v27.28,9.14
N$11
  Bottom 0.254: U7.25 8.6,29.97 7.34,28.7 5.18,28.7 JP1.1
N$12
  Bottom 0.254: JP1.2 7.55,31.16 8.1,30.61 11.9,30.61 U7.26
N$13
  Bottom 0.254: U7.27 9.25,31.57 JP1.3
N$14
  Bottom 0.254: JP1.4 9.11,35.17 9.11,32.64 9.62,32.13 10.89,32.13 11.15,32.38 12.04,32.38 U7.28
N$15
  Top 0.254: U4.5 36.64,6.34 R3.2
N$16
  Bottom 0.254: U7.15 21.4,30.77 21.81,30.35 21.81,27.3 20.93,26.42 20.93,21.46 19.66,20.19 14.96,20.19 14.45,19.69 9.5,19.69 8.61,18.8 8.61,16.19 JP2.4
N$17
  Bottom 0.254: JP2.3 7.16,18.49 8.86,20.19 14.19,20.19 14.7,20.7 19.4,20.7 20.42,21.72 20.42,28.32 20.67,28.58 20.67,29.94 U7.16
N$18
  Bottom 0.254: U7.17 19.25,28.47 19.91,27.81 19.91,22.1 19.15,21.34 14.45,21.34 14.07,20.95 6.43,20.95 JP2.2
N$19  (via drill 0.5)
  Top 0.254: v23.97,37.46 v26.77,37.46
  Bottom 0.254: U7.30 13.25,33.97 13.94,33.27 17.75,33.27 19.27,34.8 20.61,34.8 U7.10 21.97,34.77 22.07,34.67 24.1,34.67 24.61,35.18 24.61,35.94 23.97,36.58 v23.97,37.46 | J3.1 v26.77,37.46
N$20  (via drill 0.5)
  Top 0.254: v29.34,31.52 28.84,31.02 28.43,30.61 28.16,30.61 27.02,30.61 25.62,32 24.61,32 23.72,32.89 v23.72,35.56
  Bottom 0.254: U7.32 13.3,35.57 14.58,34.29 17.12,34.29 18.64,35.81 19.4,35.81 20.29,36.7 22.7,36.7 23.21,36.2 23.59,36.2 23.72,36.07 v23.72,35.56 | v29.34,31.52 29.34,32.52 J6.1
N$21  (via drill 0.5)
  Top 0.254: v22.32,35.56 22.32,35.94 22.96,36.58 24.1,36.58 24.74,35.94 24.74,33.78 25.75,32.77 v26.64,32.77
  Bottom 0.254: U7.31 13.34,34.77 14.32,33.78 17.37,33.78 18.89,35.31 19.78,35.31 20.04,35.56 U7.9 v22.32,35.57 v22.32,35.56 | v26.64,32.77 J5.1
N$28
  Bottom 0.254: U7.7 18.39,37.09 18.39,38.35 18.51,38.48 18.51,41.02 18.26,41.27 15.85,41.27 15.5,41.62 Y2.2
N$29
  Bottom 0.254: U7.8 19.15,41.78 18.39,42.55 Y2.1
N$30
  Bottom 0.254: U7.20 16.75,25.68 C13.1
N$33
  Bottom 0.254: U7.18 18.35,27.72 18.64,27.43 R7.1
REG_IN  (via drill 0.5)
  Top 0.61: U3.3 29.41,23.65 30.2,22.86 30.2,19.81 30.32,19.69
  Bottom 0.254: U2.1 25.24,22.29 25.24,20.45 26.54,20.45 U2.3
  Bottom 0.406: S1.O 17.62,8.76 20.16,11.3 24.86,11.3 26.64,13.08 29.69,13.08 30.58,13.97 30.58,17.15 v30.09,17.77 28.93,18.8 28.55,18.8 | C9.1 31.72,19.43 31.47,19.18 30.2,19.18
  Bottom 0.61: U2.3 26.96,20.39 28.55,18.8
  other vias: 30.35,19.01
  pour Top (isolate 0.305, rank 2): 29.05,17.27 29.05,21.34 30.45,21.34 30.96,20.83 30.96,18.16 30.07,17.27
  pour Bottom: 30.07,17.15 30.96,18.03 30.96,19.69 27.78,19.69 27.28,19.18 27.28,17.53 27.66,17.15
RRG_IN
  pour Bottom: 30.07,17.02 30.58,17.02 30.7,17.15 30.7,17.65
RST  (via drill 0.5)
  Top 0.254: ESP.RESET 21.94,41.4 22.2,41.66 v22.32,41.66 22.32,40.64 22.7,40.26 22.96,40.26 23.47,39.75 23.47,38.61 23.08,38.23 22.7,38.23 22.07,37.59 22.07,36.58 20.93,35.43 ESP.GPIO16 | ESP.RESET | SJ1.1 v43.66,31.5 | ESP.RESET 18.77,41.4 17.37,40 13.43,40 12.42,38.99 12.42,38.48 11.27,37.34 11.27,36.96 10.13,35.81 10.13,34.8 8.86,33.53 8.86,32.64 7.59,31.37 7.59,29.46 6.83,28.7 6.83,23.88 7.08,23.62 7.59,23.62 8.73,22.48 8.73,21.97 8.86,21.84 8.86,19.81 v9.88,18.8 | v13.94,18.8 R9.2
  Bottom 0.254: v22.32,41.66 J7.1 23.56,42.51 23.97,42.93 37.31,42.93 38.58,41.66 38.58,36.58 v43.66,31.5 | v9.88,18.8 v13.94,18.8
VBUS  (via drill 0.5)
  Top 0.254: U5.8 30.32,12.18 30.32,11.56 29.98,11.22 U5.7 29.31,11.19 29.31,10.41 29.71,10.02 v30.34,10.02 | D1.A 39.24,14.73 40.36,14.73 40.61,14.99 40.61,18.54 39.21,19.94 R18.2
  Bottom 0.254: 31.85,8.68 C5.2
  other vias: 31.59,10.02 32.84,10.02 34.09,10.02 35.34,10.02 34.09,11.27 35.34,11.27 36.59,11.27
  pour Bottom (isolate 0.305): 30.32,6.1 30.32,7.49 30.32,7.62 30.58,7.87 32.48,7.87 32.74,8.13 32.74,8.76 32.99,9.02 37.31,9.02 37.82,9.53 37.82,12.06 37.44,12.45 34.13,12.45 32.86,11.18 30.32,11.18 29.82,10.67 29.82,8.51 29.05,7.75 29.05,5.08 29.31,4.83 29.94,4.83 30.32,5.21
  pour Top (isolate 0.305): 34.51,11.18 35.53,12.19 35.53,15.49 36.04,16 39.59,16 40.36,15.24 40.36,14.1 39.85,13.59 38.45,13.59 37.56,12.7 37.56,9.14 37.31,8.89 35.66,8.89 34.9,9.65 31.72,9.65 31.21,10.16 31.21,11.18
VDD
  Top 0.254: U5.6 28.78,10.05 29.31,9.53 29.31,8.89 29.56,8.64 C4.2

### Text on the board
bNames: 1btn.09.12.15.PS